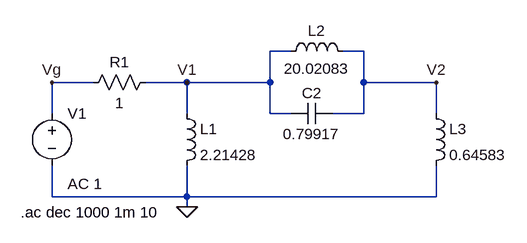
[diagram p0: schematic ej1.asc]
ej1.asc, the LTspice schematic file:
Version 4
SHEET 1 880 680
WIRE 304 32 272 32
WIRE 416 32 384 32
WIRE 0 80 -64 80
WIRE 144 80 80 80
WIRE 272 80 272 32
WIRE 272 80 144 80
WIRE 416 80 416 32
WIRE 528 80 416 80
WIRE -64 128 -64 80
WIRE 144 128 144 80
WIRE 272 128 272 80
WIRE 304 128 272 128
WIRE 416 128 416 80
WIRE 416 128 368 128
WIRE 528 128 528 80
WIRE -64 256 -64 208
WIRE 144 256 144 208
WIRE 144 256 -64 256
WIRE 528 256 528 208
WIRE 528 256 144 256
WIRE 144 272 144 256
FLAG 144 272 0
FLAG 144 80 V1
FLAG -64 80 Vg
FLAG 528 80 V2
SYMBOL ind 128 112 R0
SYMATTR InstName L1
SYMATTR Value 2.21428
SYMATTR SpiceLine Rser=0
SYMBOL ind 288 48 R270
WINDOW 0 32 56 VTop 2
WINDOW 3 5 56 VBottom 2
SYMATTR InstName L2
SYMATTR Value 20.02083
SYMBOL ind 512 112 R0
SYMATTR InstName L3
SYMATTR Value 0.64583
SYMATTR SpiceLine Rser=0
SYMBOL cap 368 112 R90
WINDOW 0 0 32 VBottom 2
WINDOW 3 32 32 VTop 2
SYMATTR InstName C2
SYMATTR Value 0.79917
SYMBOL res 96 64 R90
WINDOW 0 0 56 VBottom 2
WINDOW 3 32 56 VTop 2
SYMATTR InstName R1
SYMATTR Value 1
SYMBOL voltage -64 112 R0
WINDOW 123 24 124 Left 2
WINDOW 39 0 0 Left 0
SYMATTR InstName V1
SYMATTR Value ""
SYMATTR Value2 AC 1
TEXT -112 280 Left 2 !.ac dec 1000 1m 10

The netlist it stands for:
* ej1.asc
L1 V1 0 2.21428 Rser=0
L2 V1 V2 20.02083
L3 V2 0 0.64583 Rser=0
C2 V2 V1 0.79917
R1 V1 Vg 1
V1 Vg 0 AC 1
.ac dec 1000 1m 10
.backanno
.end

* Results of the author's LTspice run, read from the files saved beside the schematic
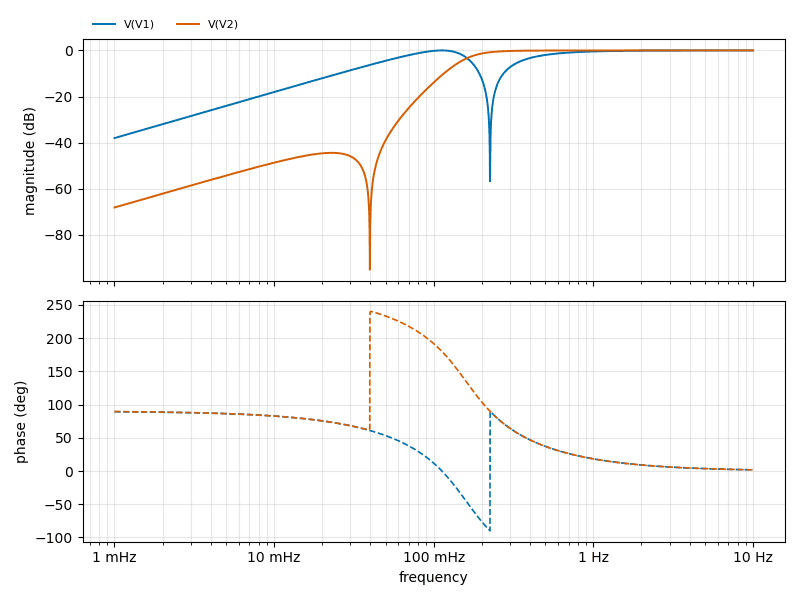
[diagram p1: AC Analysis of ej1.asc, plotted from the saved traces]
* AC Analysis, 1 run:
*   V(V1): -38.02 dB at 1 mHz, -0.00 dB at 10 Hz, peak -0.00 dB at 112.5 mHz, 3 dB below the peak at 60.79 mHz and 159.2 mHz
*   V(V2): -68.12 dB at 1 mHz, -0.00 dB at 10 Hz, peak -0.00 dB at 10 Hz, 3 dB below the peak at 166 mHz